# Altium schematic sheet amplification.SchDoc
size A
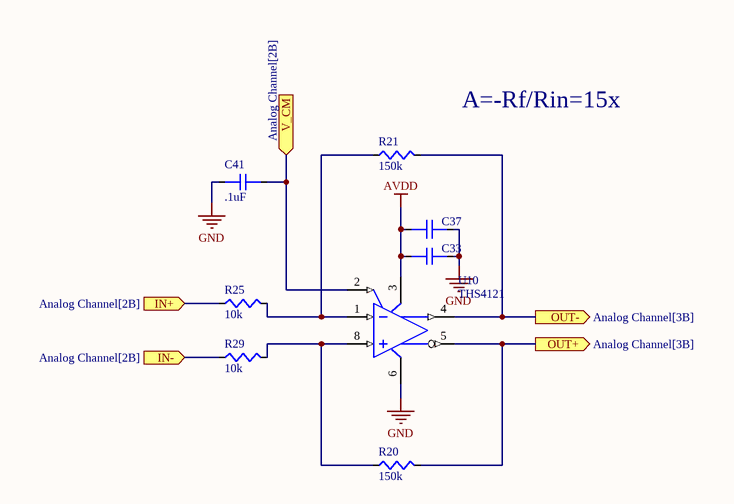
[diagram p0: amplification.SchDoc]

## Parts
C33  .1uF  [C0603]  (value not drawn)
C37  2.2uF  [C0603]  (value not drawn)
C41  .1uF  [C0603]
R20  150k  [R0603]
R21  150k  [R0603]
R25  10k  [R0603]
R29  10k  [R0603]
U10  THS4121  [DGN8_1P89X1P57-L]

## Ports
IN+ (in, see Analog Channel[2B]), IN- (in, see Analog Channel[2B]), OUT+ (out, see Analog Channel[3B]), OUT- (out, see Analog Channel[3B]), V_CM (in, see Analog Channel[2B])

## Nets
AVDD: C33.1 C37.1 U10.3(VS+)
GND: C33.2 C37.2 C41.1 U10.6(VS-)
IN+: R25.1 ; port IN+
IN-: R29.1 ; port IN-
OUT+: R20.2 U10.5(VOUT-) ; port OUT+
OUT-: R21.2 U10.4(VOUT+) ; port OUT-
V_CM: C41.2 U10.2(VOCM) ; port V_CM
NetR20_1: R20.1 R29.2 U10.8(VIN+)
NetR21_1: R21.1 R25.2 U10.1(VIN-)

## Notes on the sheet
- A=-Rf/Rin=15x

## Library data of the parts
C33 C41 = VJ0603Y104JXJCW1BC: 0603 0.1 uF 16 V ±5 % Tolerance X7R SMT Multilayer Ceramic Chip Capacitor; Manufacturer 1: Vishay Vitramon; Dielectric Material: Tantalum; Tolerance: 5%; Capacitance: 100nF; Voltage Rating: 16V; Supplier 1: Digi-Key; Supplier Part Number 1: 720-1685-1-ND; Manufacturer Part Number 1: VJ0603Y104JXJCW1BC; Stock 1: 6936; Pricing 1: 1=0.20000, 10=0.13400, 100=0.06780, 500=0.04636, 1000=0.04101 (USD); RoHS: Yes; Mount: Surface Mount; Case/Package: 0603; Number of Pins: 2; Case Code (Imperial): 0603; Case Code (Metric): 1608; Contact Plating: Tin,Matte; Min Operating Temperature: -55°C; Max Operating Temperature: 125°C; Packaging: Tape and Reel; Voltage Rating (DC): 16V; Package Quantity: 4000; Dielectric: X7R; Termination: SMD/SMT; Length: 1.6mm; Height: 0.95mm; Width: 0.8mm; Depth: 0.8mm; Lead Free: Lead Free; ComponentLink1URL: https://datasheet.ciiva.com/5424/vjw1bcbascomseries-223529-5424533.pdf?src-supplier=Mouser; ComponentLink1Description: https://datasheet.ciiva.com/5424/vjw1bcbascomseries-223529-5424533.pdf?src-supplier=Mouser; ComponentLink2URL: https://datasheet.ciiva.com/11491/vjw1bcbascomseries-11491768.pdf?src-supplier=Avnet; ComponentLink2Description: https://datasheet.ciiva.com/11491/vjw1bcbascomseries-11491768.pdf?src-supplier=Avnet; ComponentLink3URL: https://datasheet.ciiva.com/16215/vjw1bcbascomseries-16215161.pdf?src-supplier=Future+Electronics; ComponentLink3Description: https://datasheet.ciiva.com/16215/vjw1bcbascomseries-16215161.pdf?src-supplier=Future+Electronics
C37 = VJ0603Y224KXJCW1BC: Cap Ceramic 0.22uF 16V X7R 10% SMD 0603 125C Paper T/R; Manufacturer 1: Vishay Vitramon; Dielectric Material: Tantalum; Capacitance: 220nF; Supplier 1: Digi-Key; Supplier Part Number 1: 720-1853-1-ND; Manufacturer Part Number 1: VJ0603Y224KXJCW1BC; Stock 1: 890490; Pricing 1: 1=0.10000, 10=0.07000, 100=0.03100, 500=0.02214, 1000=0.01739 (USD); RoHS: Yes; Mount: Surface Mount; Case/Package: 0603; Min Operating Temperature: -55°C; Max Operating Temperature: 125°C; Tolerance: 10%; Packaging: Tape and Reel; Dielectric: X7R; Voltage Rating (DC): 16V; Length: 1.6mm; Depth: 0.8mm; Lead Free: Lead Free; ComponentLink1URL: https://datasheet.ciiva.com/11490/vjw1bcbascomseries-11490982.pdf?src-supplier=Avnet; ComponentLink1Description: https://datasheet.ciiva.com/11490/vjw1bcbascomseries-11490982.pdf?src-supplier=Avnet
R20 R21 = CRGCQ0603F150K: CRGCQ 0603 150K 1%; Manufacturer 1: Yageo; Manufacturer Part Number 1: RC0603JR-0710KL; Resistance: 10kR; Tolerance: 5%; Temperature Coefficient: 100ppm/°C; Voltage Rating (DC): 50V; Power Rating: 100mW; Supplier 1: Digi-Key; Stock 1: 22910838; Pricing 1: 1=0.10000, 10=0.01700, 100=0.00710, 1000=0.00318, 2500=0.00276 (USD); RoHS: Yes; Case/Package: 0603; Number of Pins: 2; Contact Plating: Tin,Matte; Case Code (Imperial): 0603; Case Code (Metric): 1608; Min Operating Temperature: -55°C; Max Operating Temperature: 155°C; Composition: Thick Film; Packaging: Tape and Reel; Voltage Rating: 50V; Termination: SMD/SMT; Military Standard: Not; Length: 1.6mm; Width: 0.8mm; Depth: 0.8mm; Radiation Hardening: No; REACH SVHC: Unknown; Lead Free: Lead Free; ComponentLink1URL: https://datasheet.ciiva.com/2452/pyu-rc0603-51-rohs-l-4-2452848.pdf?src-supplier=Digi-Key; ComponentLink1Description: https://datasheet.ciiva.com/2452/pyu-rc0603-51-rohs-l-4-2452848.pdf?src-supplier=Digi-Key; ComponentLink2URL: https://datasheet.ciiva.com/7746/443971-7746427.pdf?src-supplier=Element14; ComponentLink2Description: https://datasheet.ciiva.com/7746/443971-7746427.pdf?src-supplier=Element14; ComponentLink3URL: https://datasheet.ciiva.com/22747/443971-22747531.pdf?src-supplier=Element14; ComponentLink3Description: https://datasheet.ciiva.com/22747/443971-22747531.pdf?src-supplier=Element14; ComponentLink4URL: https://datasheet.ciiva.com/7746/443971-7746428.pdf?src-supplier=Element14; ComponentLink4Description: https://datasheet.ciiva.com/7746/443971-7746428.pdf?src-supplier=Element14; ComponentLink5URL: https://datasheet.ciiva.com/15189/getdatasheetpartid-327958-15189847.pdf?src-supplier=Verical; ComponentLink5Description: https://datasheet.ciiva.com/15189/getdatasheetpartid-327958-15189847.pdf?src-supplier=Verical; ComponentLink6URL: https://datasheet.ciiva.com/8883/pyu-rc0603-51-rohs-l-4-8883049.pdf?src-supplier=Avnet; ComponentLink6Description: https://datasheet.ciiva.com/8883/pyu-rc0603-51-rohs-l-4-8883049.pdf?src-supplier=Avnet; Supplier Part Number 1: 311-10KGRCT-ND
R25 R29 = RC0603JR-0710KL: RES SMD 10K OHM 5% 1/10W 0603
U10 = THS4121: IC OPAMP DIFF 1 CIRCUIT 8MSOP; Manufacturer 1: Texas Instruments; Manufacturer Part Number 1: THS4121IDGNR; Number of Channels: 1; Slew Rate: 220V/µs; -3db Bandwidth: 150MHz; Output Current per Channel: 65mA; Gain Bandwidth Product: 135MHz; Input Bias Current: 1uA; Input Offset Voltage (Vos): 50uV; Operating Supply Current: 1.35mA; Max I/O Voltage: 8mV; Max Supply Voltage: 3.5V; Min Supply Voltage: 3V; Voltage Gain: 66dB; Power Supply Rejection Ratio (PSRR): 68dB; Power Dissipation: 1.71W; Common Mode Rejection Ratio: 64dB; Max Input Voltage: -100mV; Nominal Supply Current: 13.5mA; Input Resistance: 820MR; Operating Supply Voltage: 3.3V; Dual Supply Voltage: 1.65V; Min Dual Supply Voltage: 1.5V; Max Dual Supply Voltage: 1.75V; Settling Time: 60ns; Mount: Surface Mount; Case/Package: VSSOP; Number of Pins: 8; Min Operating Temperature: -40°C; Max Operating Temperature: 125°C; Packaging: Cut Tape; Number of Circuits: 1; Number of Amplifiers: 1; Bandwidth: 135MHz; REACH SVHC: No SVHC; Lead Free: Lead Free; ComponentLink1URL: http://www.ti.com/lit/ds/symlink/ths4551.pdf?src-supplier=Digi-Key; ComponentLink1Description: http://www.ti.com/lit/ds/symlink/ths4551.pdf?src-supplier=Digi-Key; ComponentLink2URL: http://www.ti.com/general/docs/lit/getliterature.tsp?genericPartNumber=THS4551&fileType=pdf&src-supplier=Farnell; ComponentLink2Description: http://www.ti.com/general/docs/lit/getliterature.tsp?genericPartNumber=THS4551&fileType=pdf&src-supplier=Farnell; ComponentLink3URL: http://www.farnell.com/datasheets/2148327.pdf?src-supplier=Element14; ComponentLink3Description: http://www.farnell.com/datasheets/2148327.pdf?src-supplier=Element14; ComponentLink4URL: https://octopart.com/click/track?ai=2118&ct=datasheets&sig=0013830&at=physicalpart&sid=370&ppid=71776714&hlid=24961842&src-supplier=TI+store; ComponentLink4Description: https://octopart.com/click/track?ai=2118&ct=datasheets&sig=0013830&at=physicalpart&sid=370&ppid=71776714&hlid=24961842&src-supplier=TI+store; ComponentLink5URL: http://sigma.octopart.com/49250154/technical_drawing/Texas-Instruments-THS4551IDGKT.pdf?src-supplier=TI+store; ComponentLink5Description: http://sigma.octopart.com/49250154/technical_drawing/Texas-Instruments-THS4551IDGKT.pdf?src-supplier=TI+store; ComponentLink6URL: http://datasheet.octopart.com/THS4551IDGKT-Texas-Instruments-datasheet-78835010.pdf?src-supplier=Element14; ComponentLink6Description: http://datasheet.octopart.com/THS4551IDGKT-Texas-Instruments-datasheet-78835010.pdf?src-supplier=Element14; ComponentLink7URL: http://datasheet.octopart.com/THS4551IDGKT-Texas-Instruments-datasheet-67294894.pdf?src-supplier=Newark; ComponentLink7Description: http://datasheet.octopart.com/THS4551IDGKT-Texas-Instruments-datasheet-67294894.pdf?src-supplier=Newark; RoHS: No; ComponentLink8URL: https://www.te.com/commerce/DocumentDelivery/DDEController?Action=srchrtrv&DocNm=1773204-3&DocType=DS&DocLang=English&src-supplier=Digi-Key; ComponentLink8Description: https://www.te.com/commerce/DocumentDelivery/DDEController?Action=srchrtrv&DocNm=1773204-3&DocType=DS&DocLang=English&src-supplier=Digi-Key; ComponentLink9URL: https://www.te.com/commerce/DocumentDelivery/DDEController?Action=srchrtrv&amp;DocNm=1773204-3&amp;DocType=DS&amp;DocLang=English&src-supplier=Digi-Key; ComponentLink9Description: https://www.te.com/commerce/DocumentDelivery/DDEController?Action=srchrtrv&amp;DocNm=1773204-3&amp;DocType=DS&amp;DocLang=English&src-supplier=Digi-Key; Supplier 1: Digi-Key; Supplier Part Number 1: 296-13343-1-ND; Stock 1: 1273; Pricing 1: 1=5.39000, 10=4.83900, 25=4.57440, 100=3.76110, 250=3.37480, 500=3.25280, 1000=2.70389 (USD); Weight: 0.000861oz; Number of Elements: 1; Max Power Dissipation: 1.71W; Package Quantity: 1; Radiation Hardening: No; ComponentLink10URL: https://datasheet.ciiva.com/15128/getdatasheetpartid-115582-15128262.pdf?src-supplier=Verical; ComponentLink10Description: https://datasheet.ciiva.com/15128/getdatasheetpartid-115582-15128262.pdf?src-supplier=Verical; ComponentLink11URL: https://datasheet.ciiva.com/26847/ths4121idgnr-26847456.pdf?src-supplier=IIIC; ComponentLink11Description: https://datasheet.ciiva.com/26847/ths4121idgnr-26847456.pdf?src-supplier=IIIC; ComponentLink12URL: https://datasheet.ciiva.com/1800/ths4121-1800147.pdf?src-supplier=Digi-Key; ComponentLink12Description: https://datasheet.ciiva.com/1800/ths4121-1800147.pdf?src-supplier=Digi-Key; ComponentLink13URL: https://datasheet.ciiva.com/1800/ths4121-1800148.pdf?src-supplier=Digi-Key; ComponentLink13Description: https://datasheet.ciiva.com/1800/ths4121-1800148.pdf?src-supplier=Digi-Key; ComponentLink14URL: https://datasheet.ciiva.com/1800/ths4121-1800149.pdf?src-supplier=Digi-Key; ComponentLink14Description: https://datasheet.ciiva.com/1800/ths4121-1800149.pdf?src-supplier=Digi-Key; ComponentLink15URL: https://datasheet.ciiva.com/2976/ths4120-2976327.pdf?src-supplier=Avnet; ComponentLink15Description: https://datasheet.ciiva.com/2976/ths4120-2976327.pdf?src-supplier=Avnet